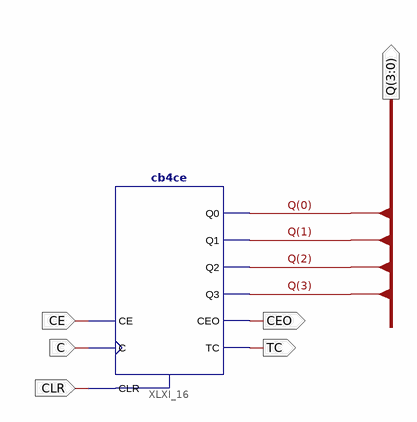
[diagram p0: schematic sheet 1]
// Xilinx ISE schematic Cb4ce_Bus.sch (spartan3e) as structural Verilog: 1 symbols, 6 ports
module Cb4ce_Bus (
  input  CE,
  input  C,
  input  CLR,
  output [3:0] Q,
  output CEO,
  output TC
);

  cb4ce XLXI_16 (.C(C), .CE(CE), .CLR(CLR), .CEO(CEO), .Q0(Q[0]), .Q1(Q[1]), .Q2(Q[2]), .Q3(Q[3]), .TC(TC));
endmodule
